# Altium schematic sheet Power_1.schdoc: TEBF0808 - Power
size A4; DocumentNumber: TEBF0808; Revision: 04; SheetNumber: 31; SheetTotal: 36; Date: 2016-09-29; CompanyName: Trenz Electronic GmbH; Organization: Trenz Electronic GmbH
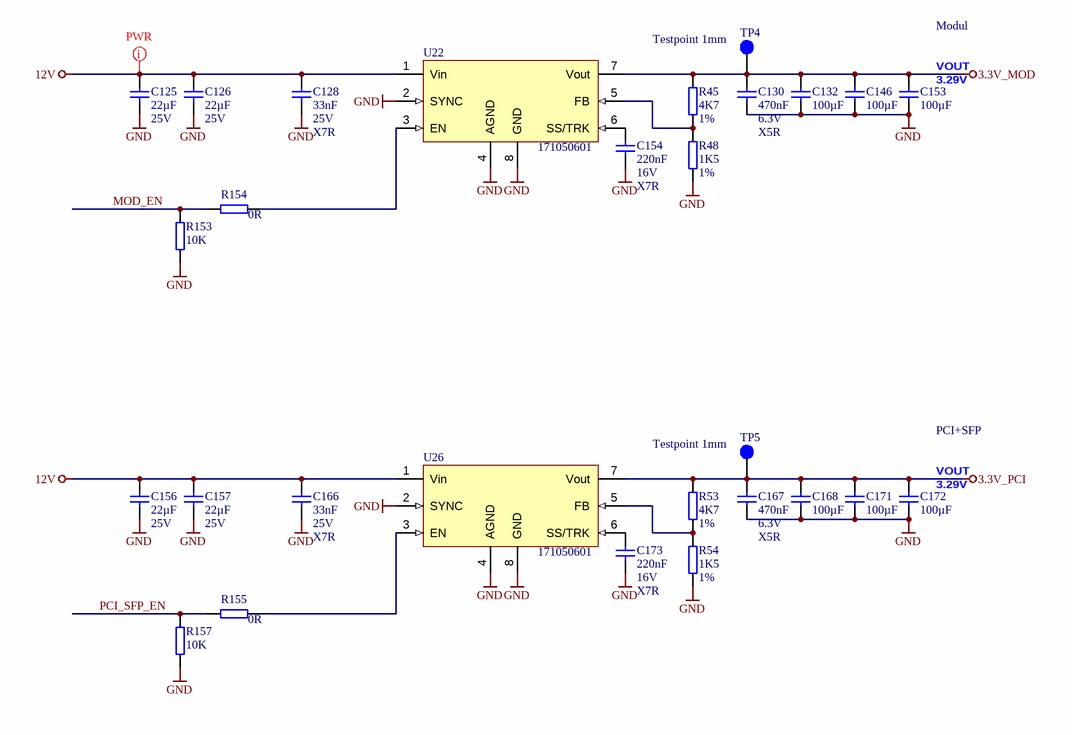
[diagram p0: Power_1.schdoc]

## Parts
C125  22µF  Voltage: 25V  [CAPC3216X180N]
C126  22µF  Voltage: 25V  [CAPC3216X180N]
C128  33nF  Voltage: 25V  Technology: X7R  [CAPC1005X55N]
C130  470nF  Voltage: 6.3V  Technology: X5R  [CAPC1005X55N]
C132  100µF  [CAPC3216X180N]
C146  100µF  [CAPC3216X180N]
C153  100µF  [CAPC3216X180N]
C154  220nF  Voltage: 16V  Technology: X7R  [CAPC1005X55N]
C156  22µF  Voltage: 25V  [CAPC3216X180N]
C157  22µF  Voltage: 25V  [CAPC3216X180N]
C166  33nF  Voltage: 25V  Technology: X7R  [CAPC1005X55N]
C167  470nF  Voltage: 6.3V  Technology: X5R  [CAPC1005X55N]
C168  100µF  [CAPC3216X180N]
C171  100µF  [CAPC3216X180N]
C172  100µF  [CAPC3216X180N]
C173  220nF  Voltage: 16V  Technology: X7R  [CAPC1005X55N]
R45  4K7  Tolerance: 1%  [RESC1005X40N]
R48  1K5  Tolerance: 1%  [RESC1005X40N]
R53  4K7  Tolerance: 1%  [RESC1005X40N]
R54  1K5  Tolerance: 1%  [RESC1005X40N]
R153  10K  [RESC1005X40N]
R154  0R  [RESC1005X40N]
R155  0R  [RESC1005X40N]
R157  10K  [RESC1005X40N]
TP4  Testpoint 1mm  [TP_1mm]
TP5  Testpoint 1mm  [TP_1mm]
U22  171050601  [7TO-PMOD]
U26  171050601  [7TO-PMOD]

## Nets
3.3V_MOD: C130.1 C132.1 C146.1 C153.1 R45.1 TP4.1 U22.7(Vout)
3.3V_PCI: C167.1 C168.1 C171.1 C172.1 R53.1 TP5.1 U26.7(Vout)
12V: C125.2 C126.2 C128.1 C156.2 C157.2 C166.1 U22.1(Vin) U26.1(Vin)
GND: C125.1 C126.1 C128.2 C130.2 C132.2 C146.2 C153.2 C154.2 C156.1 C157.1 C166.2 C167.2 C168.2 C171.2 C172.2 C173.2 R48.2 R54.2 R153.1 R157.1 U22.2(SYNC) U22.4(AGND) U22.8(GND) U26.2(SYNC) U26.4(AGND) U26.8(GND)
MOD_EN: R153.2 R154.2
PCI_SFP_EN: R155.2 R157.2
NetC154_1: C154.1 U22.6(SS/TRK)
NetC173_1: C173.1 U26.6(SS/TRK)
NetR45_2: R45.2 R48.1 U22.5(FB)
NetR53_2: R53.2 R54.1 U26.5(FB)
NetR154_1: R154.1 U22.3(EN)
NetR155_1: R155.1 U26.3(EN)

## Layout directives
net class PWR: 12V

## Notes on the sheet
- Modul
- (near C153) VOUT
- (near C153) 3.29V
- PCI+SFP
- (near C172) 3.29V
- (near C172) VOUT
- Title:
- Number:
- Rev.
- Date:
- A4
- Copyright:
- Page
- of
- Filename:

## Library data of the parts
C125 C126 C156 C157 = 24886: KON 22µF X5R 25V SMD 10%; AN: 24886; Value: 22u; Mixed: SMT; Preferred: Yes; Case: 3216 (1206); Tolerance: 10%
C128 C166 = 23916: KON 33nF 25V X7R SMD; AN: 23916; Value: 33n; Mixed: SMT; Preferred: Yes; Case: 1005 (0402)
C130 C167 = 23659: KON 470nF 6,3V X5R SMD; AN: 23659; Mixed: SMT; Value: 470n; Preferred: Yes; Case: 1005 (0402)
C132 C146 C153 C168 C171 C172 = 23116: KON 100µF 6,3V X5R SMD 20%; AN: 23116; Mixed: SMT; Value: 100u; Preferred: Yes; Voltage: 6.3V; Case: 3216 (1206); Tolerance: 20%; Technology: X5R
C154 C173 = 22768: KON 220nF 16V X7R SMD; AN: 22768; Mixed: SMT; Value: 220n; Case: 1005 (0402)
R45 R53 = 22585: WID SMD 4K7 1% 0,063W; AN: 22585; Mixed: SMT; Value: 4.7K; Preferred: Yes; Case: 1005 (0402); Technology: TK100
R48 R54 = 22602: WID SMD 1K5 1% 0,063W; AN: 22602; Mixed: SMT; Value: 1.5K; Preferred: Yes; Case: 1005 (0402); Technology: TK100
R153 R157 = 22750: WID SMD 10K 1% 0,063W; AN: 22750; Mixed: SMT; Preferred: Yes; Case: 1005 (0402); Value: 10K; Tolerance: 1%; Technology: TK100
R154 R155 = 22738: WID SMD 0R; AN: 22738; Tolerance: 1%; Mixed: SMT; Value: 0; Preferred: Yes; Case: 1005 (0402); Technology: TK100
TP4 TP5 = 25063: AN: 25063; Mixed: SMT
U22 U26 = 26051: AN: 26051; Mixed: SMT; Case: TO263-7EP; HelpURL: B:\AD\adlib\datasheet\171050601; H-ART: 171050601